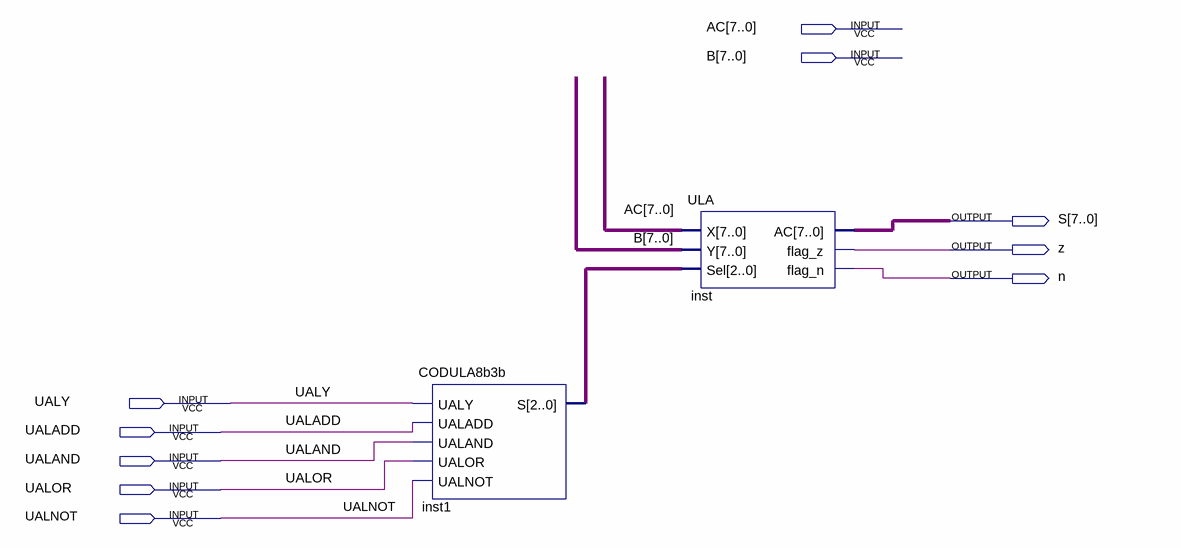
[diagram p0: schematic sheet]
// Quartus schematic teste_ula_cod_decod.bdf as structural Verilog: 2 symbols, 10 pins
module teste_ula_cod_decod (
  input  [7:0] AC,
  input  [7:0] B,
  input  UALY,
  input  UALADD,
  input  UALAND,
  input  UALOR,
  input  UALNOT,
  output [7:0] S,
  output z,
  output n
);

  wire [2:0] inst1_s;

  CODULA8b3b inst1 (.UALY(UALY), .UALADD(UALADD), .UALAND(UALAND), .UALOR(UALOR), .UALNOT(UALNOT), .S(inst1_s));
  ULA inst (.X(AC), .Y(B), .Sel(inst1_s), .AC(S), .flag_z(z), .flag_n(n));
endmodule
